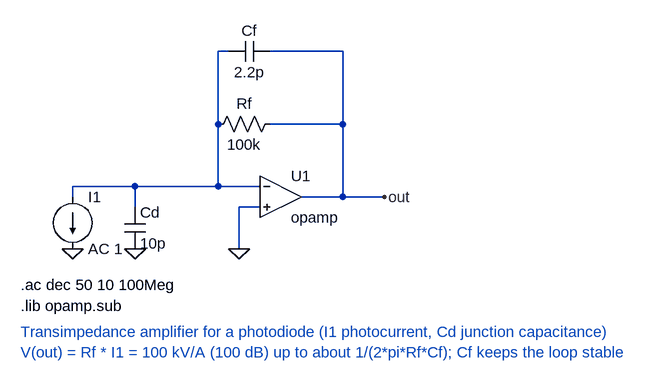
[diagram p0: schematic transimpedance_amplifier.asc]
transimpedance_amplifier.asc, the LTspice schematic file:
Version 4
SHEET 1 880 680
WIRE 336 -64 336 144
WIRE 352 -64 336 -64
WIRE 528 -64 416 -64
WIRE 528 160 528 -64
WIRE 528 48 416 48
WIRE 112 144 112 160
WIRE 208 144 112 144
WIRE 400 144 208 144
WIRE 208 176 208 144
WIRE 368 176 400 176
WIRE 368 240 368 176
WIRE 592 160 464 160
FLAG 112 240 0
FLAG 208 240 0
FLAG 368 240 0
FLAG 592 160 out
SYMBOL current 112 160 R0
SYMATTR InstName I1
SYMATTR Value AC 1
SYMBOL cap 192 176 R0
SYMATTR InstName Cd
SYMATTR Value 10p
SYMBOL res 432 32 R90
WINDOW 0 0 56 VBottom 2
WINDOW 3 32 56 VTop 2
SYMATTR InstName Rf
SYMATTR Value 100k
SYMBOL cap 416 -80 R90
WINDOW 0 0 32 VBottom 2
WINDOW 3 32 32 VTop 2
SYMATTR InstName Cf
SYMATTR Value 2.2p
SYMBOL OpAmps\opamp 432 96 R0
SYMATTR InstName U1
TEXT 32 296 Left 2 !.ac dec 50 10 100Meg
TEXT 32 328 Left 2 !.lib opamp.sub
TEXT 32 368 Left 2 ;Transimpedance amplifier for a photodiode (I1 photocurrent, Cd junction capacitance)\nV(out) = Rf * I1 = 100 kV/A (100 dB) up to about 1/(2*pi*Rf*Cf); Cf keeps the loop stable

The netlist it stands for:
* transimpedance_amplifier.asc
I1 N001 0 AC 1
Cd N001 0 10p
Rf out N001 100k
Cf out N001 2.2p
XU1 N001 0 out opamp Aol=100K GBW=10Meg  ; pins invin noninvin out
.ac dec 50 10 100Meg
.lib opamp.sub
* Transimpedance amplifier for a photodiode (I1 photocurrent, Cd junction capacitance)
* V(out) = Rf * I1 = 100 kV/A (100 dB) up to about 1/(2*pi*Rf*Cf); Cf keeps the loop stable
.backanno
.end